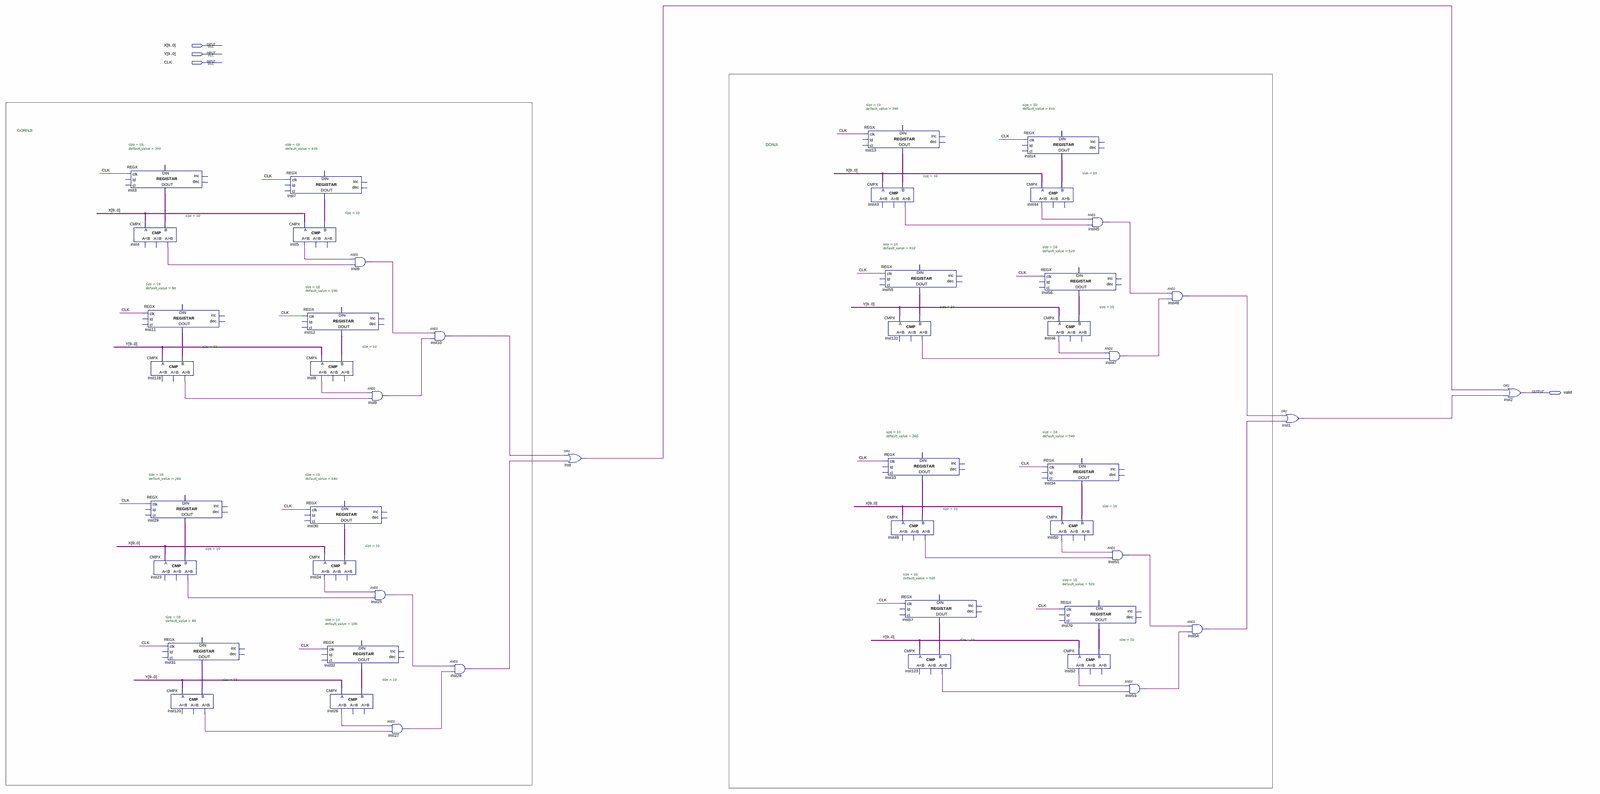
[diagram p0: schematic sheet, whole]
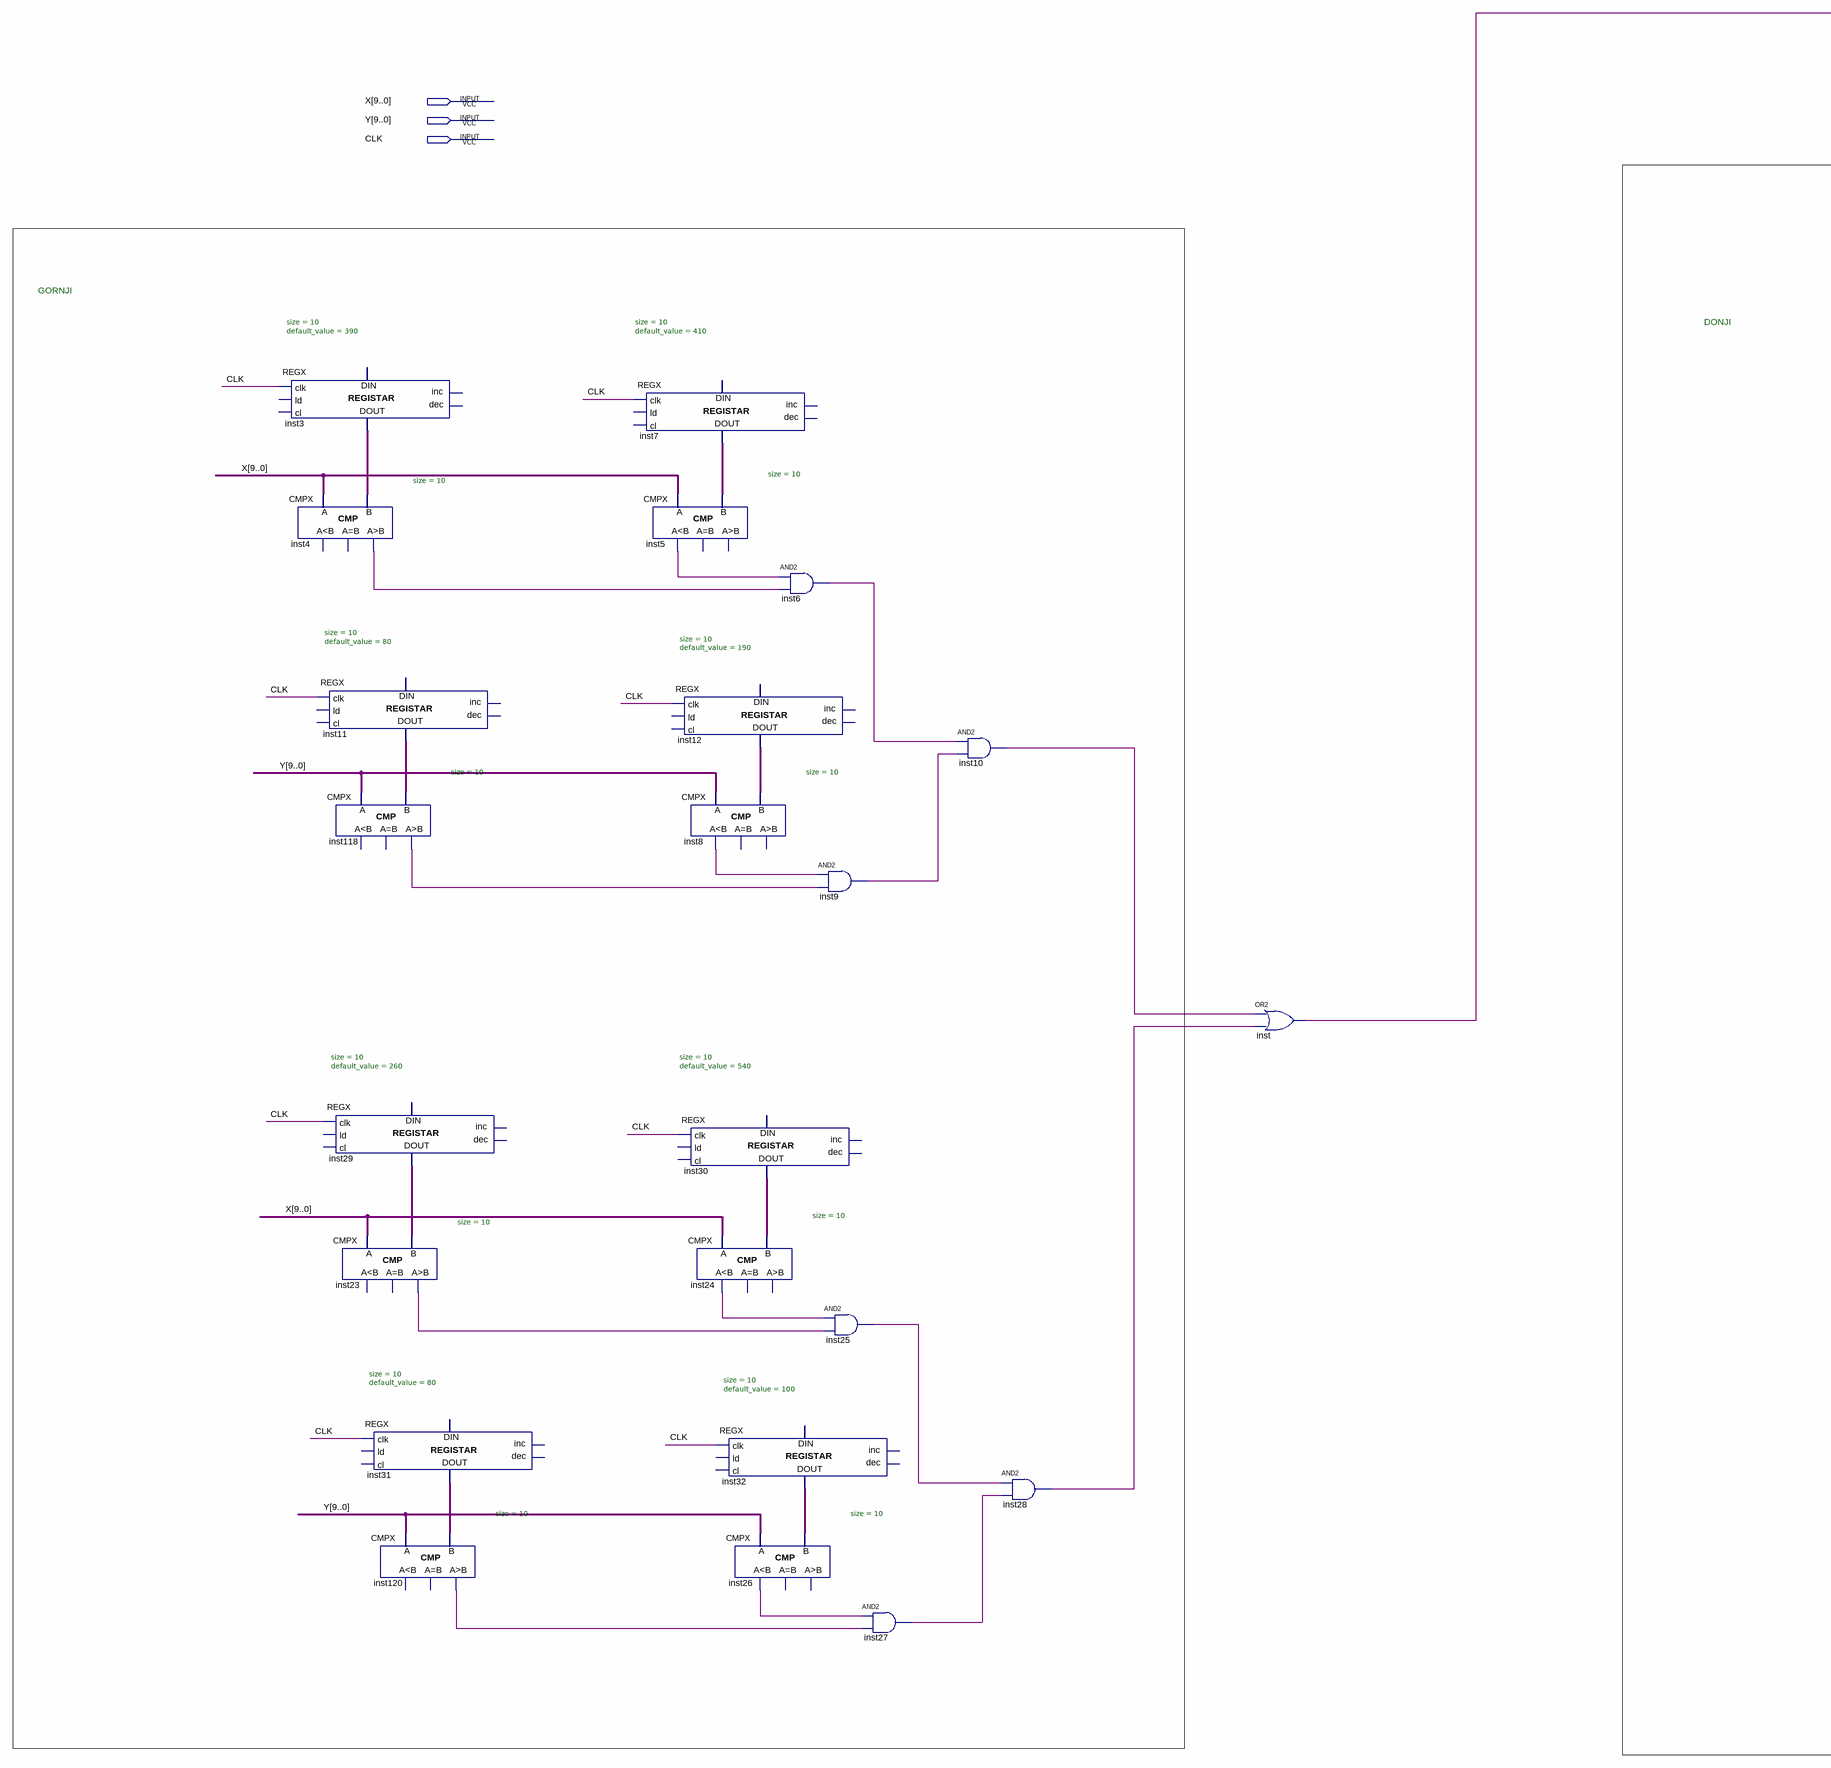
[diagram p1: schematic sheet, left part]
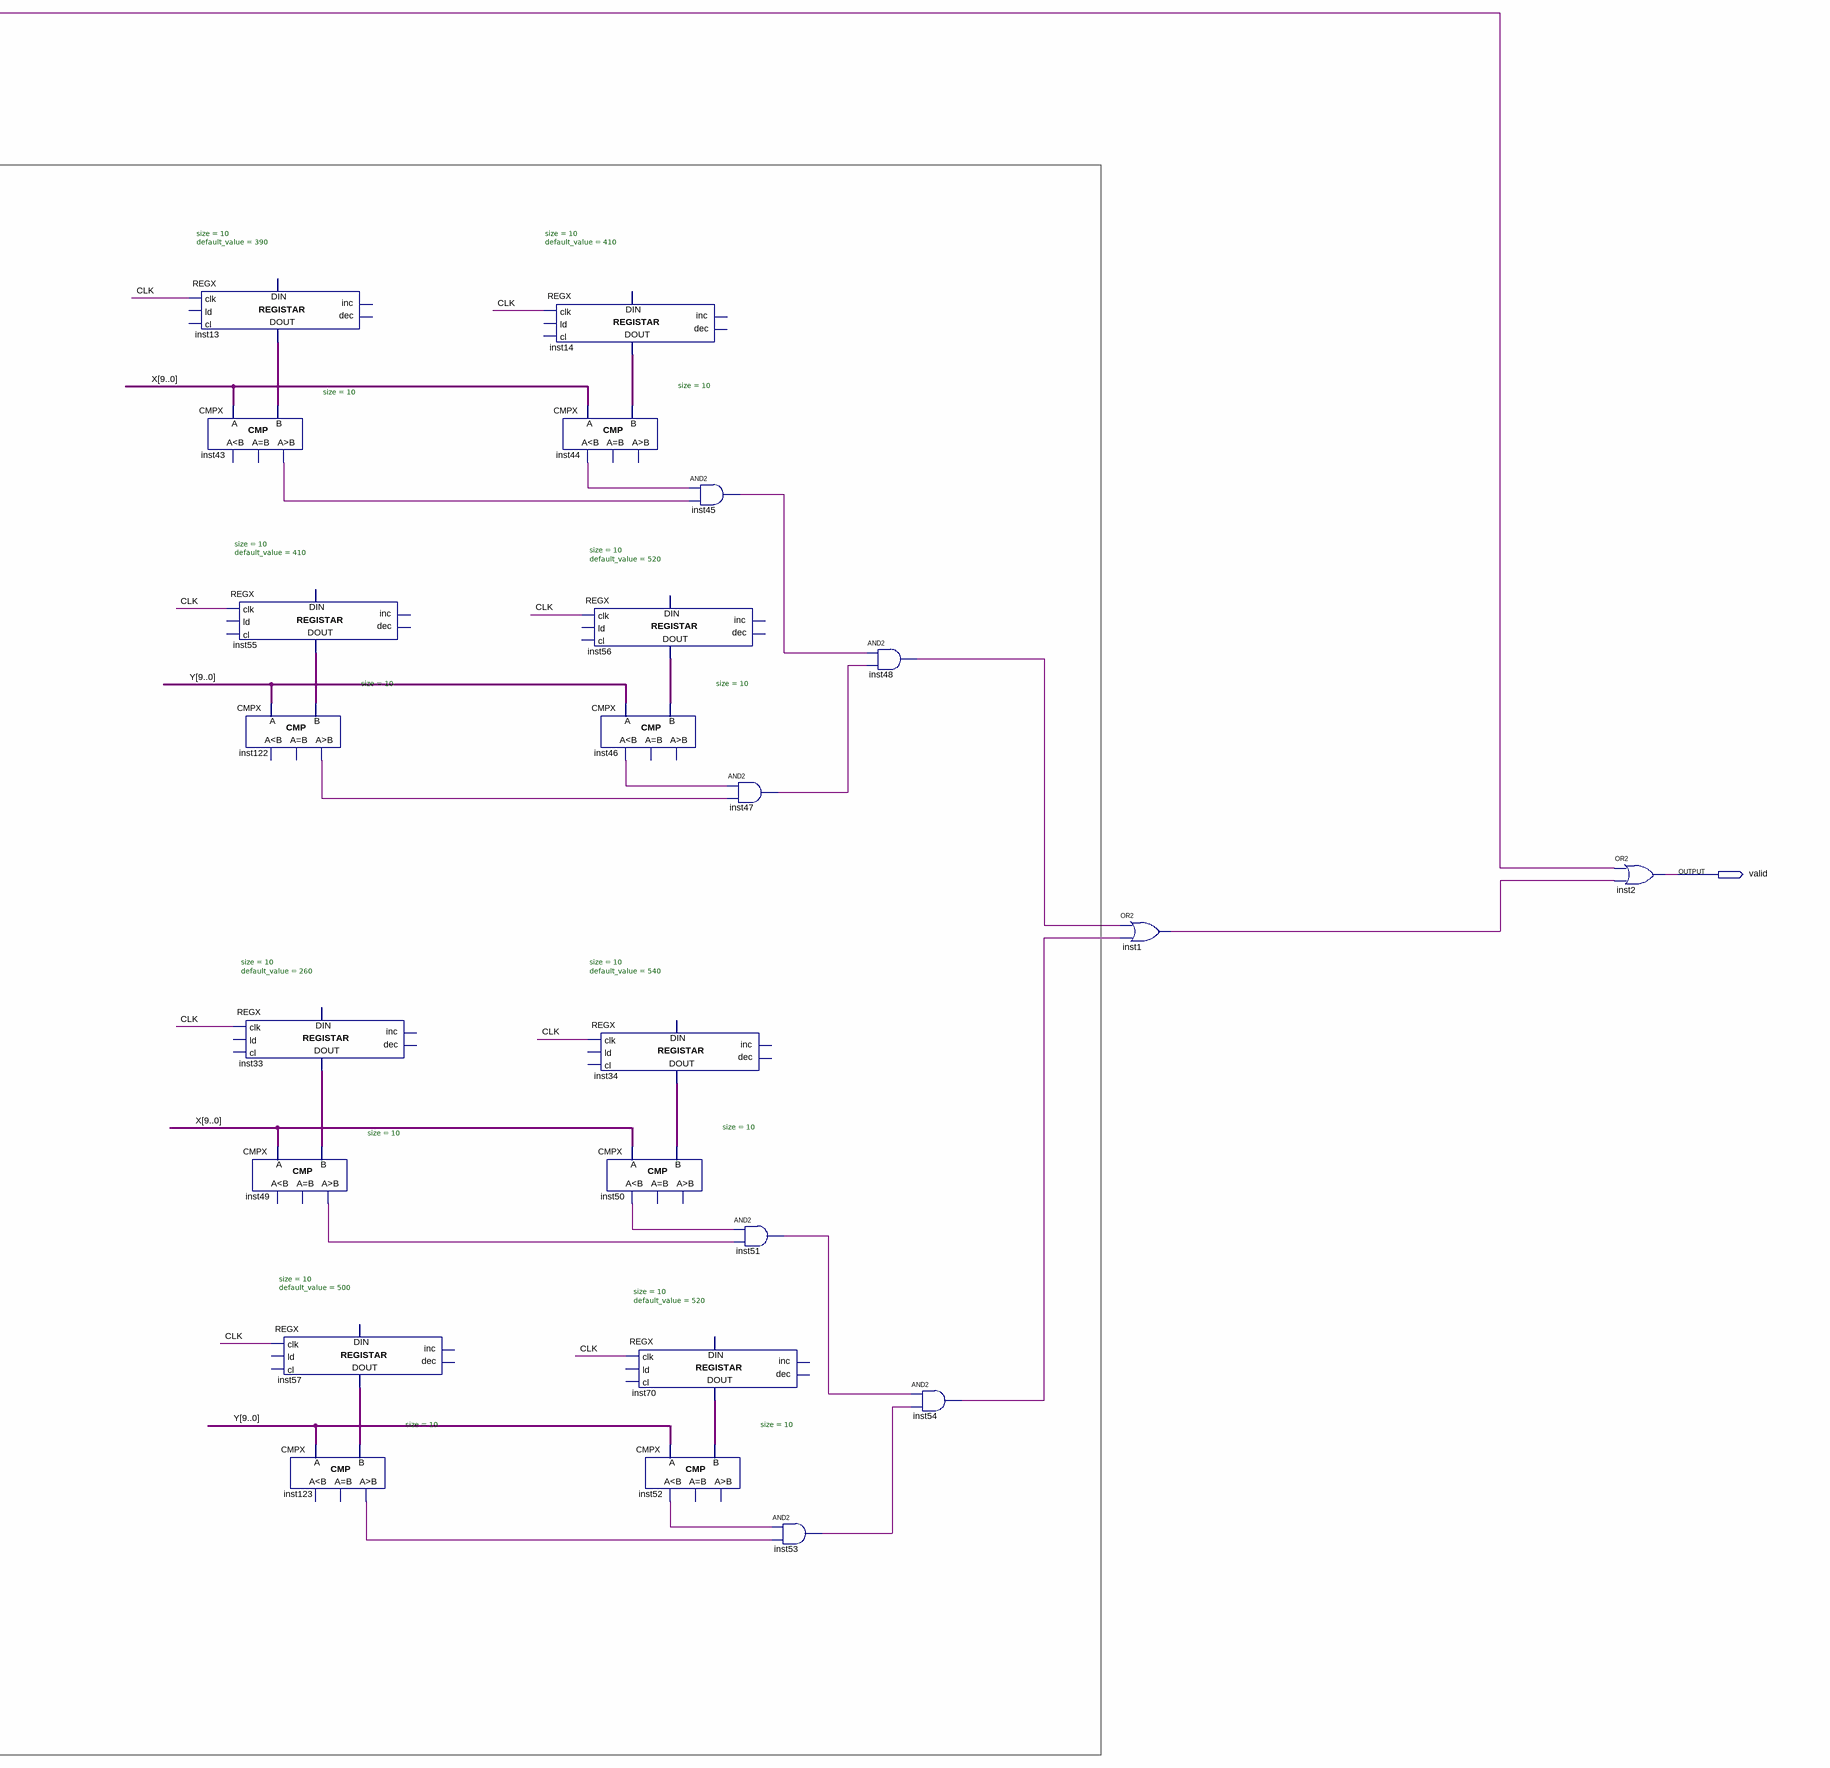
[diagram p2: schematic sheet, right part]
// Quartus schematic blokovi_T.bdf as structural Verilog: 47 symbols, 4 pins
module blokovi_T (
  input  [9:0] X,
  input  [9:0] Y,
  input  CLK,
  output valid
);

  wire inst1_out, inst4_gr, inst5_ls, inst6_out, inst8_ls, inst9_out, inst10_out, inst23_gr, inst24_ls,
       inst25_out, inst26_ls, inst27_out, inst28_out, inst43_gr, inst44_ls, inst45_out, inst46_ls,
       inst47_out, inst48_out, inst49_gr, inst50_ls, inst51_out, inst52_ls, inst53_out, inst54_out,
       inst118_gr, inst120_gr, inst122_gr, inst123_gr, inst_out;
  wire [9:0] inst3_data_out, inst7_data_out, inst11_data_out, inst12_data_out, inst13_data_out,
       inst14_data_out, inst29_data_out, inst30_data_out, inst31_data_out, inst32_data_out, inst33_data_out,
       inst34_data_out, inst55_data_out, inst56_data_out, inst57_data_out, inst70_data_out;

  REGX #(.size(10), .default_value(390)) inst3 (
    .clk(CLK), .data_out(inst3_data_out));  // open: ld, cl, inc, dec, data_in
  CMPX #(.size(10)) inst4 (.A(X), .B(inst3_data_out), .gr(inst4_gr));  // open: ls, eq
  REGX #(.size(10), .default_value(80)) inst11 (
    .clk(CLK), .data_out(inst11_data_out));  // open: ld, cl, inc, dec, data_in
  CMPX #(.size(10)) inst118 (.A(Y), .B(inst11_data_out), .gr(inst118_gr));  // open: ls, eq
  REGX #(.size(10), .default_value(260)) inst29 (
    .clk(CLK), .data_out(inst29_data_out));  // open: ld, cl, inc, dec, data_in
  CMPX #(.size(10)) inst23 (.A(X), .B(inst29_data_out), .gr(inst23_gr));  // open: ls, eq
  REGX #(.size(10), .default_value(80)) inst31 (
    .clk(CLK), .data_out(inst31_data_out));  // open: ld, cl, inc, dec, data_in
  CMPX #(.size(10)) inst120 (.A(Y), .B(inst31_data_out), .gr(inst120_gr));  // open: ls, eq
  REGX #(.size(10), .default_value(410)) inst7 (
    .clk(CLK), .data_out(inst7_data_out));  // open: ld, cl, inc, dec, data_in
  CMPX #(.size(10)) inst5 (.A(X), .B(inst7_data_out), .ls(inst5_ls));  // open: eq, gr
  REGX #(.size(10), .default_value(190)) inst12 (
    .clk(CLK), .data_out(inst12_data_out));  // open: ld, cl, inc, dec, data_in
  CMPX #(.size(10)) inst8 (.A(Y), .B(inst12_data_out), .ls(inst8_ls));  // open: eq, gr
  REGX #(.size(10), .default_value(540)) inst30 (
    .clk(CLK), .data_out(inst30_data_out));  // open: ld, cl, inc, dec, data_in
  CMPX #(.size(10)) inst24 (.A(X), .B(inst30_data_out), .ls(inst24_ls));  // open: eq, gr
  REGX #(.size(10), .default_value(100)) inst32 (
    .clk(CLK), .data_out(inst32_data_out));  // open: ld, cl, inc, dec, data_in
  CMPX #(.size(10)) inst26 (.A(Y), .B(inst32_data_out), .ls(inst26_ls));  // open: eq, gr
  and inst6 (inst6_out, inst5_ls, inst4_gr);
  and inst9 (inst9_out, inst8_ls, inst118_gr);
  and inst25 (inst25_out, inst24_ls, inst23_gr);
  and inst27 (inst27_out, inst26_ls, inst120_gr);
  and inst10 (inst10_out, inst6_out, inst9_out);
  and inst28 (inst28_out, inst25_out, inst27_out);
  or inst (inst_out, inst10_out, inst28_out);
  REGX #(.size(10), .default_value(390)) inst13 (
    .clk(CLK), .data_out(inst13_data_out));  // open: ld, cl, inc, dec, data_in
  CMPX #(.size(10)) inst43 (.A(X), .B(inst13_data_out), .gr(inst43_gr));  // open: ls, eq
  REGX #(.size(10), .default_value(410)) inst55 (
    .clk(CLK), .data_out(inst55_data_out));  // open: ld, cl, inc, dec, data_in
  CMPX #(.size(10)) inst122 (.A(Y), .B(inst55_data_out), .gr(inst122_gr));  // open: ls, eq
  REGX #(.size(10), .default_value(260)) inst33 (
    .clk(CLK), .data_out(inst33_data_out));  // open: ld, cl, inc, dec, data_in
  CMPX #(.size(10)) inst49 (.A(X), .B(inst33_data_out), .gr(inst49_gr));  // open: ls, eq
  REGX #(.size(10), .default_value(500)) inst57 (
    .clk(CLK), .data_out(inst57_data_out));  // open: ld, cl, inc, dec, data_in
  CMPX #(.size(10)) inst123 (.A(Y), .B(inst57_data_out), .gr(inst123_gr));  // open: ls, eq
  REGX #(.size(10), .default_value(410)) inst14 (
    .clk(CLK), .data_out(inst14_data_out));  // open: ld, cl, inc, dec, data_in
  CMPX #(.size(10)) inst44 (.A(X), .B(inst14_data_out), .ls(inst44_ls));  // open: eq, gr
  REGX #(.size(10), .default_value(520)) inst56 (
    .clk(CLK), .data_out(inst56_data_out));  // open: ld, cl, inc, dec, data_in
  CMPX #(.size(10)) inst46 (.A(Y), .B(inst56_data_out), .ls(inst46_ls));  // open: eq, gr
  REGX #(.size(10), .default_value(540)) inst34 (
    .clk(CLK), .data_out(inst34_data_out));  // open: ld, cl, inc, dec, data_in
  CMPX #(.size(10)) inst50 (.A(X), .B(inst34_data_out), .ls(inst50_ls));  // open: eq, gr
  REGX #(.size(10), .default_value(520)) inst70 (
    .clk(CLK), .data_out(inst70_data_out));  // open: ld, cl, inc, dec, data_in
  CMPX #(.size(10)) inst52 (.A(Y), .B(inst70_data_out), .ls(inst52_ls));  // open: eq, gr
  and inst45 (inst45_out, inst44_ls, inst43_gr);
  and inst47 (inst47_out, inst46_ls, inst122_gr);
  and inst51 (inst51_out, inst50_ls, inst49_gr);
  and inst53 (inst53_out, inst52_ls, inst123_gr);
  and inst48 (inst48_out, inst45_out, inst47_out);
  and inst54 (inst54_out, inst51_out, inst53_out);
  or inst1 (inst1_out, inst48_out, inst54_out);
  or inst2 (valid, inst_out, inst1_out);

  // Notes on the sheet:
  //   GORNJI
  //   DONJI
endmodule
